# Altium project 电机控制器.PrjPCB
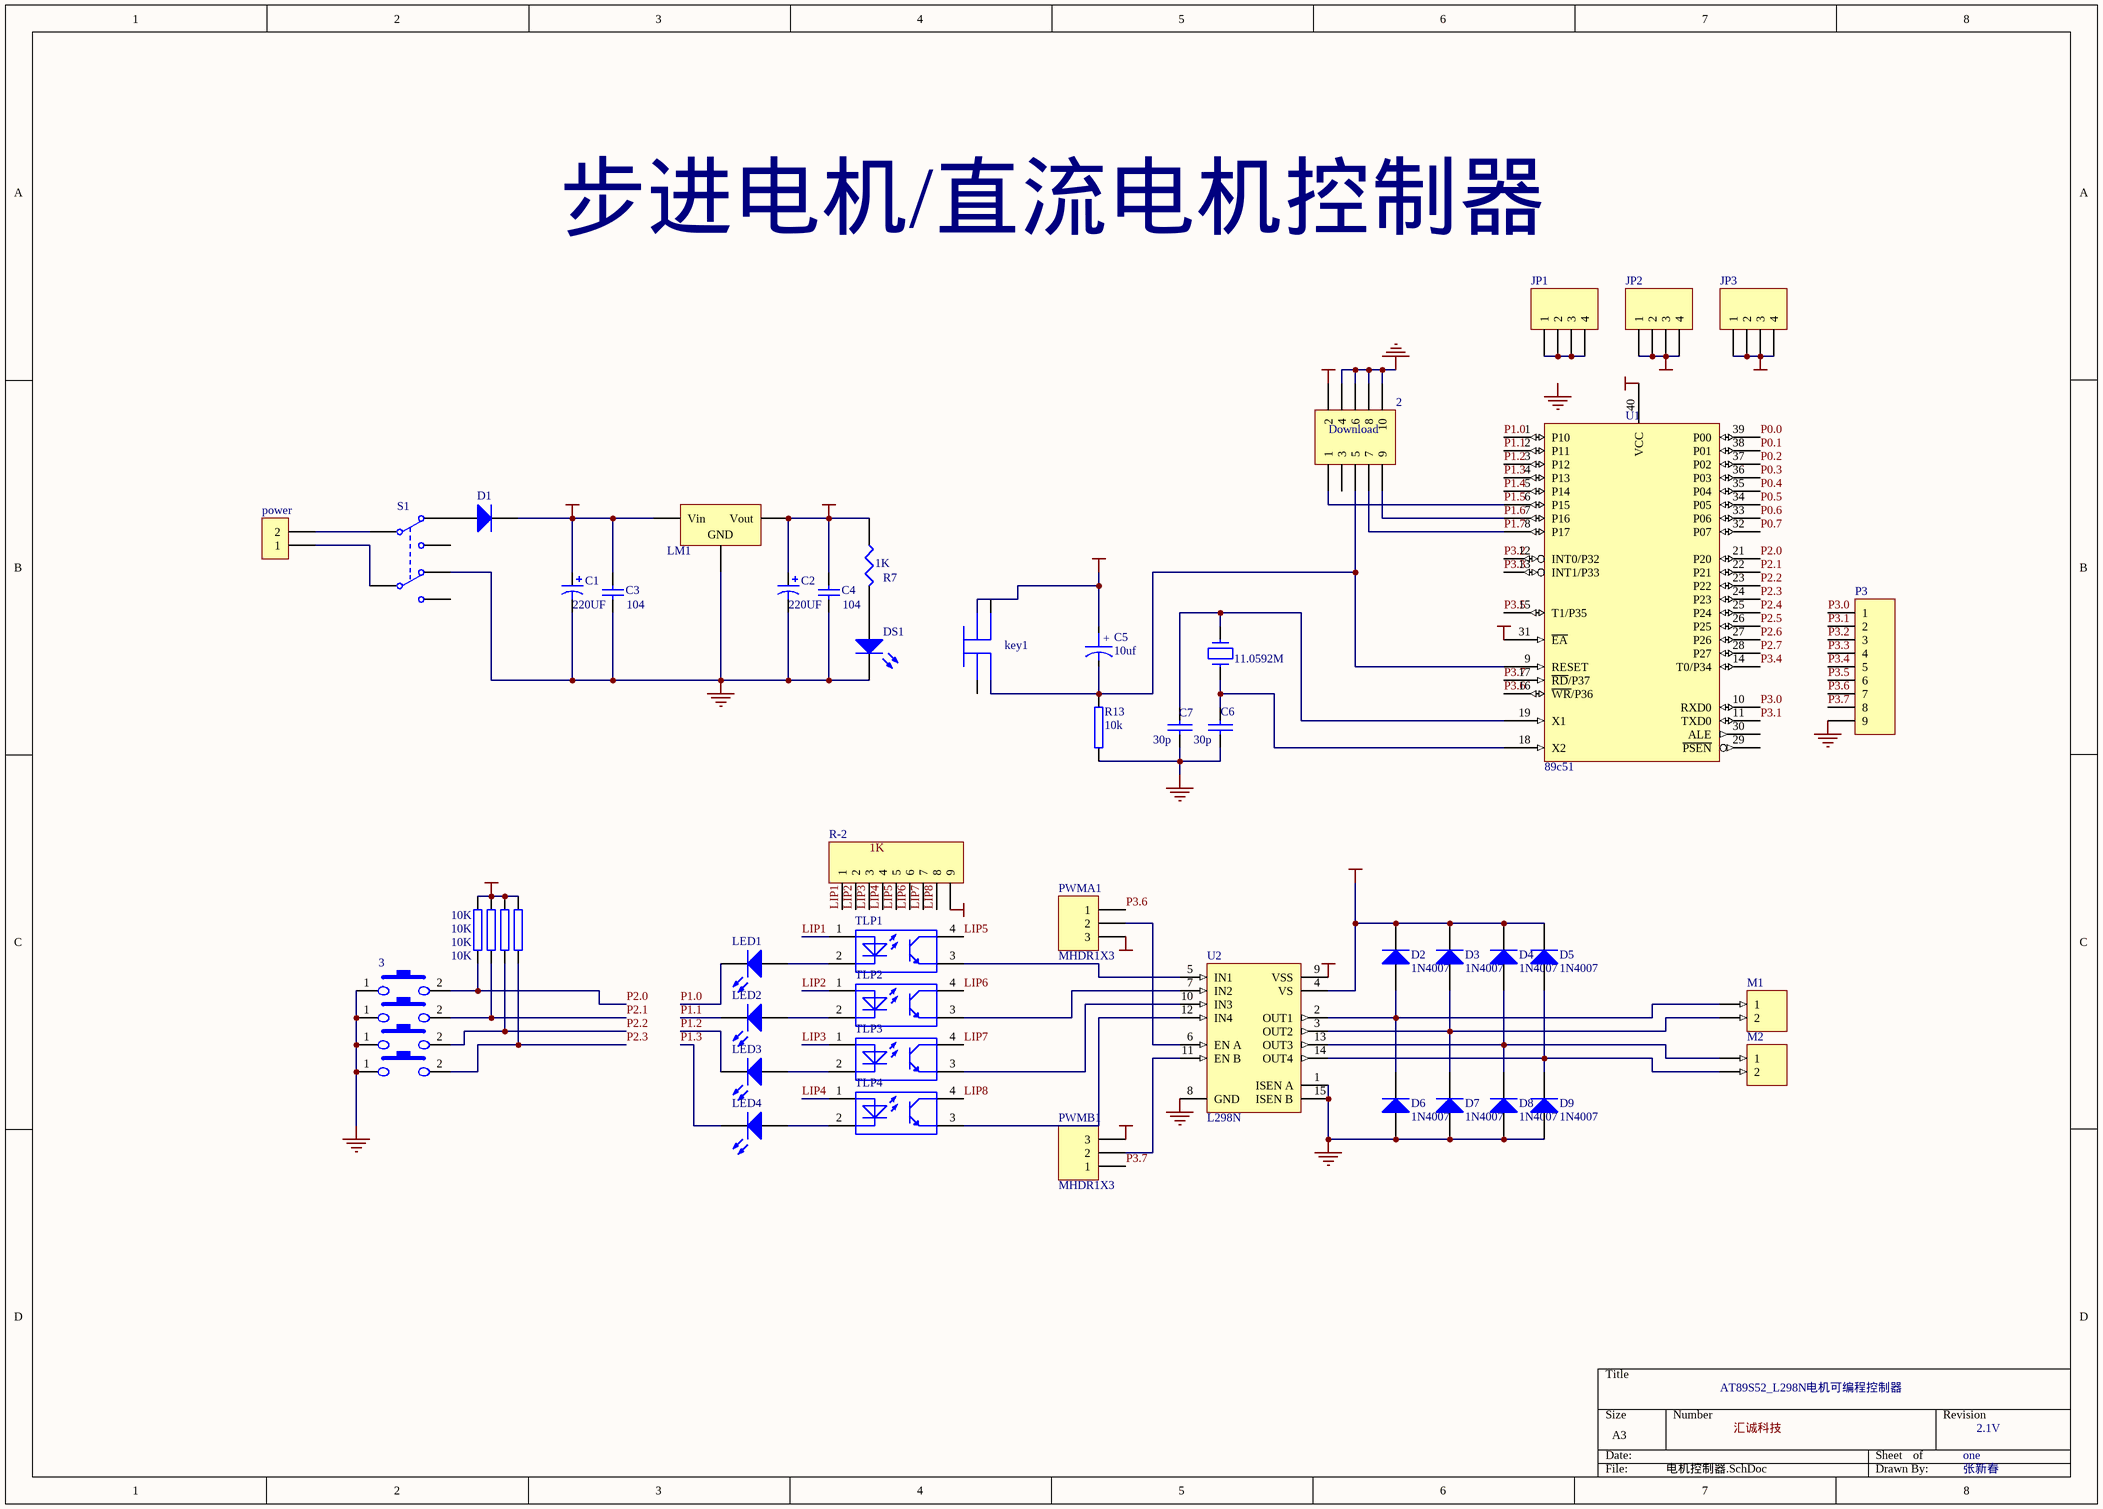
[diagram p0: 电机控制器.SchDoc]
1 sheet, 52 parts. Net scope: global (net labels, ports and power ports of the same name join across sheets).
Board file: 电机控制器.PcbDoc

## Sheet 电机控制器.SchDoc
size A3

### Parts
1  power  [DZ-2]
2  Download  [HDR2X5]
3  key1  [AN66]  (value not drawn)
4  key2  [AN66]  (value not drawn)
5  key3  [AN66]  (value not drawn)
6  key4  [AN66]  (value not drawn)
C1  value 220UF  [CD6]
C2  value 220UF  [CD4]
C3  value 104  [HDR1X2]
C4  value 104  [HDR1X2]
C5  10uf  [CD5]
C6  30p  [C1608-0603]
C7  30p  [C1608-0603]
D1  (no value)  [DIO10.46-5.3x2.8]
D2  1N4007  [DIO7.8-4.6x2]
D3  1N4007  [DIO7.8-4.6x2]
D4  1N4007  [DIO7.8-4.6x2]
D5  1N4007  [DIO7.8-4.6x2]
D6  1N4007  [DIO7.8-4.6x2]
D7  1N4007  [DIO7.8-4.6x2]
D8  1N4007  [DIO7.8-4.6x2]
D9  1N4007  [DIO7.8-4.6x2]
DS1  (no value)  [HDR1X2]
JP1  (no value)  [HDR1X4]
JP2  (no value)  [HDR1X4]
JP3  (no value)  [HDR1X4]
key1  KEY  [AN66]  (value not drawn)
LED1  (no value)  [HDR1X2]
LED2  (no value)  [HDR1X2]
LED3  (no value)  [HDR1X2]
LED4  (no value)  [HDR1X2]
LM1  (no value)  [wyk]
M1  (no value)  [DZ-2]
M2  (no value)  [DZ-2]
P3  (no value)  [HDR1X9]
PWMA1  MHDR1X3  [MHDR1X3]
PWMB1  MHDR1X3  [MHDR1X3]
R7  1K  [HDR1X2]
R13  10k  [INDC2012-0805]
R15  10K  [INDC2012-0805]
R16  10K  [INDC2012-0805]
R17  10K  [INDC2012-0805]
R18  10K  [INDC2012-0805]
R-2  (no value)  [HDR1X9]
S1  (no value)  [DPDT-6]
TLP1  (no value)  [DIP4]
TLP2  (no value)  [DIP4]
TLP3  (no value)  [DIP4]
TLP4  (no value)  [DIP4]
U1  89c51  [DIP40]
U2  L298N  [DFM-T15/X1.6V]
Y1  11.0592M  [SPST-2]

### Nets
+5V: 2.2 C2.1 C4.2 C5.1 JP2.1 JP2.2 JP2.3 JP2.4 key1.1 LM1.3(Vout) PWMA1.3 PWMB1.3 R7.1 R15.2 R16.2 R17.2 R18.2 R-2.9 U1.31(~{EA}) U1.40(VCC) U2.9(VSS)
+12V: C1.1 C3.2 D1.2(K) D2.2(K) D3.2(K) D4.2(K) D5.2(K) JP3.1 JP3.2 JP3.3 JP3.4 LM1.1(Vin) U2.4(VS)
GND: 2.4 2.6 2.8 2.10 3.1 4.1 5.1 6.1 C1.2 C2.2 C3.1 C4.1 C6.2 C7.2 D6.1(A) D7.1(A) D8.1(A) D9.1(A) DS1.2(K) LM1.2(GND) P3.9 R13.2 S1.4(NC2) U1.20(GND) U2.1(ISEN_A) U2.8(GND) U2.15(ISEN_B)
LIP1: R-2.1 TLP1.1
LIP2: R-2.2 TLP2.1
LIP3: R-2.3 TLP3.1
LIP4: R-2.4 TLP4.1
LIP5: R-2.5 TLP1.4
LIP6: R-2.6 TLP2.4
LIP7: R-2.7 TLP3.4
LIP8: R-2.8 TLP4.4
P0.0: U1.39(P00)
P0.1: U1.38(P01)
P0.2: U1.37(P02)
P0.3: U1.36(P03)
P0.4: U1.35(P04)
P0.5: U1.34(P05)
P0.6: U1.33(P06)
P0.7: U1.32(P07)
P1.0: LED1.2(K) U1.1(P10)
P1.1: LED2.2(K) U1.2(P11)
P1.2: LED3.2(K) U1.3(P12)
P1.3: LED4.2(K) U1.4(P13)
P1.4: U1.5(P14)
P1.5: 2.1 U1.6(P15)
P1.6: 2.9 U1.7(P16)
P1.7: 2.7 U1.8(P17)
P2.0: 3.2 R17.1 U1.21(P20)
P2.1: 4.2 R18.1 U1.22(P21)
P2.2: 5.2 R15.1 U1.23(P22)
P2.3: 6.2 R16.1 U1.24(P23)
P2.4: U1.25(P24)
P2.5: U1.26(P25)
P2.6: U1.27(P26)
P2.7: U1.28(P27)
P3.0: P3.1 U1.10(RXD0)
P3.1: P3.2 U1.11(TXD0)
P3.2: P3.3 U1.12(INT0/P32)
P3.3: P3.4 U1.13(INT1/P33)
P3.4: P3.5 U1.14(T0/P34)
P3.5: P3.6 U1.15(T1/P35)
P3.6: P3.7 PWMA1.1 U1.16(~{WR}/P36)
P3.7: P3.8 PWMB1.1 U1.17(~{RD}/P37)
Net1_1: 1.1 S1.5(COMMON2)
Net1_2: 1.2 S1.1(COMMON1)
Net2_5: 2.5 C5.2 key1.2 R13.1 U1.9(RESET)
NetC6_1: C6.1 U1.18(X2) Y1.2
NetC7_1: C7.1 U1.19(X1) Y1.1
NetD1_1: D1.1(A) S1.2(NC1)
NetD2_1: D2.1(A) D6.2(K) M1.1 U2.2(OUT1)
NetD3_1: D3.1(A) D7.2(K) M1.2 U2.3(OUT2)
NetD4_1: D4.1(A) D8.2(K) M2.1 U2.13(OUT3)
NetD5_1: D5.1(A) D9.2(K) M2.2 U2.14(OUT4)
NetDS1_1: DS1.1(A) R7.2
NetJP1_1: JP1.1 JP1.2 JP1.3 JP1.4
NetLED1_1: LED1.1(A) TLP1.2
NetLED2_1: LED2.1(A) TLP2.2
NetLED3_1: LED3.1(A) TLP3.2
NetLED4_1: LED4.1(A) TLP4.2
NetPWMA1_2: PWMA1.2 U2.6(EN_A)
NetPWMB1_2: PWMB1.2 U2.11(EN_B)
NetTLP1_3: TLP1.3 U2.5(IN1)
NetTLP2_3: TLP2.3 U2.7(IN2)
NetTLP3_3: TLP3.3 U2.10(IN3)
NetTLP4_3: TLP4.3 U2.12(IN4)

Not connected (* = marked no-connect by the designer): 2 3; key1 0 3; S1 3(NO1) 6(NO2); U1 29(~{PSEN}) 30(ALE)

### Notes on the sheet
- 步进电机/直流电机控制器
- AT89S52_L298N电机可编程控制器
- one
- 2.1V
- 张新春
- Labels drawn without touching a wire or pin: 1K, GND, 汇诚科技
- (in symbol CAPACITOR POL) +

### Library data of the parts
2 = Header 5X2: Header, 5-Pin, Dual row; Revision: 17-Jul-2002: Re-released for DXP Platform.; Publisher: Altium Limited
3-6 = key
C1 C2 = Cap Pol1: Polarized Capacitor (Radial); Published: 8-Jun-2000; LatestRevisionDate: 17-Jul-2002; LatestRevisionNote: Re-released for DXP Platform.; Publisher: Altium Limited
C3 C4 = Cap: Capacitor; Published: 8-Jun-2000; LatestRevisionDate: 17-Jul-2002; LatestRevisionNote: Re-released for DXP Platform.; Publisher: Altium Limited
C5 = CAPACITOR POL: Capacitor
C6 C7 = CAP: Capacitor
D1-D9 = Diode 1N4007: 1 Amp General Purpose Rectifier; Published: 8-Jun-2000; LatestRevisionDate: 17-Jul-2002; LatestRevisionNote: Re-released for DXP Platform.; DatasheetDocument: 1998; PackageDocument: Aug-1999; PackageReference: DO-41; Publisher: Altium Limited; Code_JEDEC: DO-204-AL
DS1 = LED0: Typical INFRARED GaAs LED; Published: 8-Jun-2000; LatestRevisionDate: 17-Jul-2002; LatestRevisionNote: Re-released for DXP Platform.; Publisher: Altium Limited
JP1-JP3 = Header 4: Header, 4-Pin; Revision: 17-Jul-2002: Re-released for DXP Platform.; Publisher: Altium Limited
LED1-LED4 = LED3: Typical BLUE SiC LED; Published: 8-Jun-2000; LatestRevisionDate: 17-Dec-2003; LatestRevisionNote: PCB Footprint replaced.; Publisher: Altium Limited
LM1 = Volt Reg: Voltage Regulator; Published: 24-Mar-1999; LatestRevisionDate: 17-Jul-2002; LatestRevisionNote: Re-released for DXP Platform.; Publisher: Altium Limited; Code_JEDEC: SMD-220
M1 M2 = MHDR1X2: Header, 2-Pin; LatestRevisionDate: 17-Jul-2002; LatestRevisionNote: Re-released for DXP Platform.; Publisher: Altium Limited
P3 R-2 = Header 9: Header, 9-Pin; Revision: 17-Jul-2002: Re-released for DXP Platform.; Publisher: Altium Limited
PWMA1 PWMB1 = MHDR1X3: Header, 3-Pin; LatestRevisionDate: 17-Jul-2002; LatestRevisionNote: Re-released for DXP Platform.; Publisher: Altium Limited
R7 = RES1
R13 R15-R18 = RES2
S1 = SW DPDT: Switch; Published: 24-Mar-1999; LatestRevisionDate: 17-Jul-2002; LatestRevisionNote: Re-released for DXP Platform.; Publisher: Altium Limited
TLP1-TLP4 = TLP521-1
U1 = 8051
U2 = L298N: Dual Full Bridge Driver; Published: 8-Jun-2000; LatestRevisionDate: 17-Jul-2002; LatestRevisionNote: Re-released for DXP Platform.; DatasheetDocument: Jul-1999; PackageDocument: Apr-1998; PackageReference: Multiwatt15H; Publisher: Altium Limited; ComponentLink1Description: Manufacturer Link; ComponentLink1URL: http://www.st.com/
Y1 = CRYSTAL